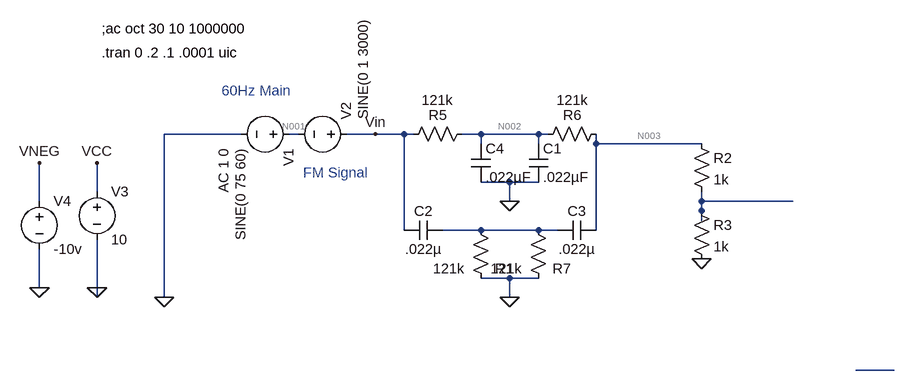
[diagram p0: schematic Isolation.asc]
Isolation.asc, the LTspice schematic file:
Version 4
SHEET 1 3480 1364
WIRE -416 96 -544 96
WIRE -320 96 -336 96
WIRE -192 96 -240 96
WIRE -144 96 -192 96
WIRE -128 96 -144 96
WIRE -16 96 -48 96
WIRE 80 96 -16 96
WIRE 96 96 80 96
WIRE -16 112 -16 96
WIRE 80 112 80 96
WIRE 176 112 176 96
WIRE 352 112 176 112
WIRE 32 176 -16 176
WIRE 80 176 32 176
WIRE -656 192 -656 144
WIRE -752 208 -752 144
WIRE 32 208 32 176
WIRE 352 208 352 192
WIRE 576 208 352 208
WIRE 352 224 352 208
WIRE 352 240 352 224
WIRE -144 256 -144 96
WIRE -16 256 -80 256
WIRE 80 256 -16 256
WIRE 112 256 80 256
WIRE 176 256 176 112
WIRE 32 336 -16 336
WIRE 80 336 32 336
WIRE -752 352 -752 288
WIRE -656 352 -656 272
WIRE -656 368 -656 352
WIRE -544 368 -544 96
WIRE 32 368 32 336
WIRE 3280 576 3216 576
FLAG -544 368 0
FLAG -192 96 Vin
FLAG 32 208 0
FLAG 32 368 0
FLAG -656 352 0
FLAG -752 352 0
FLAG -656 144 VCC
FLAG -752 144 VNEG
FLAG 352 304 0
SYMBOL voltage -320 96 R90
WINDOW 123 24 124 Left 2
WINDOW 39 0 0 Left 2
SYMATTR Value2 AC 1 0
SYMATTR InstName V1
SYMATTR Value SINE(0 75 60)
SYMBOL voltage -224 96 M270
WINDOW 39 0 0 Left 2
WINDOW 3 24 -12 Left 2
WINDOW 123 0 0 Left 2
SYMATTR Value SINE(0 1 3000)
SYMATTR InstName V2
SYMBOL res -32 80 R90
WINDOW 0 0 56 VBottom 2
WINDOW 3 -56 57 VTop 2
SYMATTR InstName R5
SYMATTR Value 121k
SYMBOL res 192 80 R90
WINDOW 0 0 56 VBottom 2
WINDOW 3 -56 56 VTop 2
SYMATTR InstName R6
SYMATTR Value 121k
SYMBOL res 96 352 R180
WINDOW 0 -38 32 Left 2
WINDOW 3 43 32 Left 2
SYMATTR InstName R7
SYMATTR Value 121k
SYMBOL cap 64 112 R0
SYMATTR InstName C1
SYMATTR Value .022µF
SYMBOL cap -80 240 R90
WINDOW 0 0 32 VBottom 2
WINDOW 3 32 32 VTop 2
SYMATTR InstName C2
SYMATTR Value .022µ
SYMATTR SpiceLine Rser=3.9
SYMBOL cap 176 240 R90
WINDOW 0 0 32 VBottom 2
WINDOW 3 32 32 VTop 2
SYMATTR InstName C3
SYMATTR Value .022µ
SYMATTR SpiceLine Rser=3.9
SYMBOL voltage -656 176 R0
WINDOW 123 0 0 Left 2
WINDOW 39 0 0 Left 2
SYMATTR InstName V3
SYMATTR Value 10
SYMBOL voltage -752 192 R0
WINDOW 123 0 0 Left 2
WINDOW 39 0 0 Left 2
SYMATTR InstName V4
SYMATTR Value -10v
SYMBOL cap -32 112 R0
SYMATTR InstName C4
SYMATTR Value .022µF
SYMBOL res 0 352 R180
WINDOW 0 -38 32 Left 2
WINDOW 3 43 32 Left 2
SYMATTR InstName R1
SYMATTR Value 121k
SYMBOL res 336 96 R0
SYMATTR InstName R2
SYMATTR Value 1k
SYMBOL res 336 208 R0
SYMATTR InstName R3
SYMATTR Value 1k
TEXT -648 -40 Left 2 !.tran 0 .2 .1 .0001 uic
TEXT -312 160 Left 2 ;FM Signal
TEXT -448 24 Left 2 ;60Hz Main
TEXT -648 -80 Left 2 !;ac oct 30 10 1000000

The netlist it stands for:
* Isolation.asc
V1 N001 0 SINE(0 75 60) AC 1 0
V2 Vin N001 SINE(0 1 3000)
R5 N002 Vin 121k
R6 N003 N002 121k
R7 0 N005 121k
C1 N002 0 .022µF
C2 N005 Vin .022µ Rser=3.9
C3 N003 N005 .022µ Rser=3.9
V3 VCC 0 10
V4 VNEG 0 -10v
C4 N002 0 .022µF
R1 0 N005 121k
R2 N003 N004 1k
R3 N004 0 1k
.tran 0 .2 .1 .0001 uic
* FM Signal
* 60Hz Main
;ac oct 30 10 1000000
.backanno
.end

* Results of the author's LTspice run, read from the files saved beside the schematic
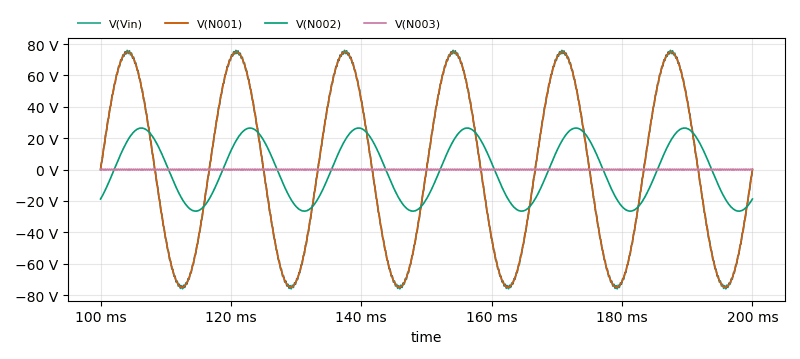
[diagram p1: Transient Analysis of Isolation.asc, plotted from the saved traces]
* Transient Analysis, 1 run:
*   V(Vin): min -75.96 V, max 75.96 V, average 0 V, rms 53.04 V, last 0 V
*   V(N001): min -75 V, max 75 V, average 0 V, rms 53.03 V, last 0 V
*   V(N002): min -26.48 V, max 26.47 V, average -2.955 µV, rms 18.72 V, last -18.76 V
*   V(N003): min -363.7 mV, max 371 mV, average -48.26 µV, rms 253.9 mV, last 355.9 mV